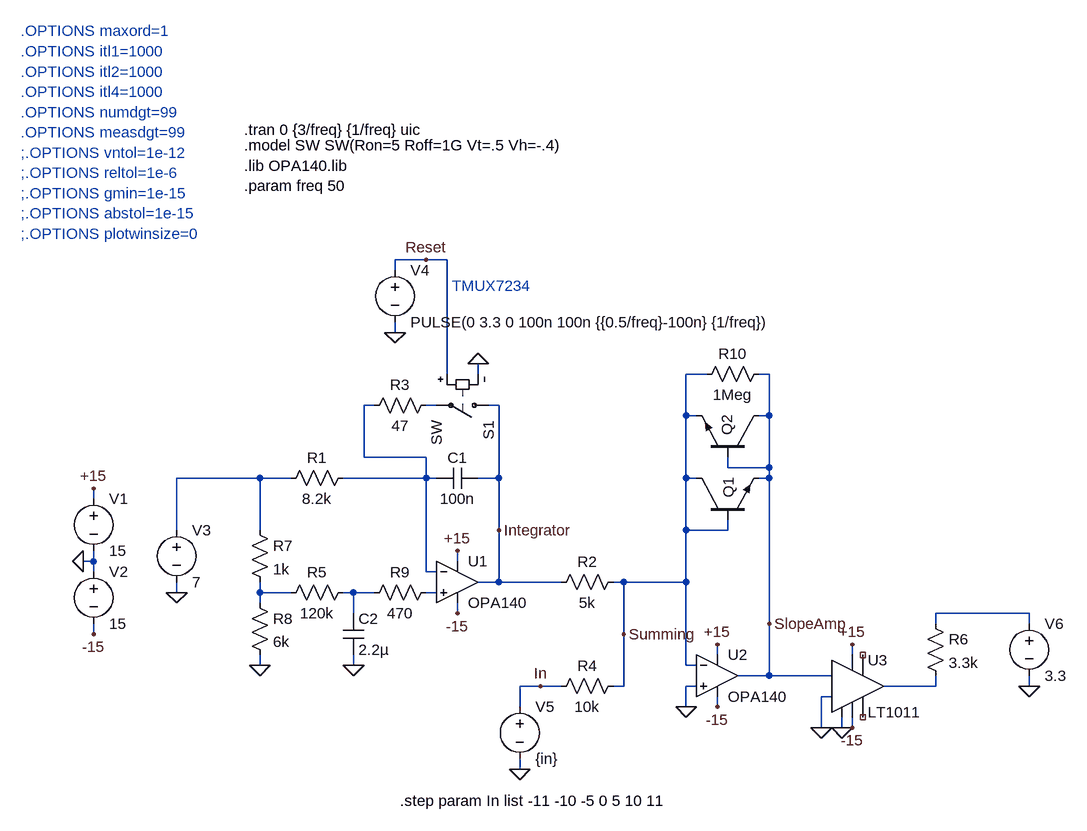
[diagram p0: schematic Single slope ADC v0.4.asc]
Single slope ADC v0.4.asc, the LTspice schematic file:
Version 4
SHEET 1 1672 760
WIRE -16 -416 -64 -416
WIRE 16 -416 -16 -416
WIRE -64 -400 -64 -416
WIRE -64 -304 -64 -320
WIRE 16 -240 16 -416
WIRE 64 -240 64 -256
WIRE 416 -240 384 -240
WIRE 512 -240 496 -240
WIRE -96 -192 -112 -192
WIRE 0 -192 -16 -192
WIRE 96 -192 80 -192
WIRE 384 -176 384 -240
WIRE 400 -176 384 -176
WIRE 512 -176 512 -240
WIRE 512 -176 496 -176
WIRE -112 -112 -112 -192
WIRE -16 -112 -112 -112
WIRE 448 -96 448 -112
WIRE 512 -96 512 -176
WIRE 512 -96 448 -96
WIRE -272 -80 -400 -80
WIRE -224 -80 -272 -80
WIRE -16 -80 -16 -112
WIRE -16 -80 -144 -80
WIRE 0 -80 -16 -80
WIRE 96 -80 96 -192
WIRE 96 -80 64 -80
WIRE 384 -80 384 -176
WIRE 400 -80 384 -80
WIRE 512 -80 512 -96
WIRE 512 -80 496 -80
WIRE -528 -48 -528 -64
WIRE -400 0 -400 -80
WIRE -272 0 -272 -80
WIRE 96 0 96 -80
WIRE 384 0 384 -80
WIRE 448 0 448 -16
WIRE 448 0 384 0
WIRE -528 48 -528 32
WIRE -528 48 -544 48
WIRE 32 48 32 32
WIRE -528 64 -528 48
WIRE -16 64 -16 -80
WIRE 0 64 -16 64
WIRE 96 80 96 0
WIRE 96 80 64 80
WIRE 192 80 96 80
WIRE 288 80 272 80
WIRE 384 80 384 0
WIRE 384 80 288 80
WIRE -400 96 -400 80
WIRE -272 96 -272 80
WIRE -224 96 -272 96
WIRE -128 96 -144 96
WIRE -96 96 -128 96
WIRE 0 96 -16 96
WIRE -272 112 -272 96
WIRE -128 128 -128 96
WIRE 32 128 32 112
WIRE 912 128 768 128
WIRE 512 144 512 -80
WIRE 768 144 768 128
WIRE 912 144 912 128
WIRE -528 160 -528 144
WIRE 288 160 288 80
WIRE 432 192 432 176
WIRE 640 192 640 176
WIRE -272 208 -272 192
WIRE -128 208 -128 192
WIRE 384 208 384 80
WIRE 400 208 384 208
WIRE 512 224 512 144
WIRE 512 224 464 224
WIRE 608 224 512 224
WIRE 160 240 128 240
WIRE 192 240 160 240
WIRE 288 240 288 160
WIRE 288 240 272 240
WIRE 400 240 384 240
WIRE 768 240 768 224
WIRE 768 240 688 240
WIRE 912 240 912 224
WIRE 608 256 592 256
WIRE 128 272 128 240
WIRE 384 272 384 240
WIRE 432 272 432 256
WIRE 592 304 592 256
WIRE 624 304 624 288
WIRE 640 304 640 288
WIRE 128 368 128 352
FLAG -544 48 0
FLAG -528 -64 +15
FLAG 32 32 +15
FLAG -528 160 -15
FLAG 32 128 -15
FLAG -400 96 0
FLAG 64 -256 0
FLAG -64 -304 0
FLAG 96 0 Integrator
FLAG 128 368 0
FLAG 288 160 Summing
FLAG 432 176 +15
FLAG 432 272 -15
FLAG 384 272 0
FLAG 512 144 SlopeAmp
FLAG -16 -416 Reset
FLAG 592 304 0
FLAG 624 304 0
FLAG 640 176 +15
FLAG 640 304 -15
FLAG 912 240 0
FLAG -272 208 0
FLAG 160 240 In
FLAG -128 208 0
SYMBOL OpAmps\\opamp2 32 16 R0
SYMATTR InstName U1
SYMATTR Value OPA140
SYMBOL voltage -528 -64 R0
WINDOW 123 0 0 Left 0
WINDOW 39 0 0 Left 0
SYMATTR InstName V1
SYMATTR Value 15
SYMBOL voltage -528 48 R0
WINDOW 123 0 0 Left 0
WINDOW 39 0 0 Left 0
SYMATTR InstName V2
SYMATTR Value 15
SYMBOL cap 64 -96 R90
WINDOW 0 0 32 VBottom 2
WINDOW 3 32 32 VTop 2
SYMATTR InstName C1
SYMATTR Value 100n
SYMBOL voltage -400 -16 R0
WINDOW 123 0 0 Left 0
WINDOW 39 0 0 Left 0
SYMATTR InstName V3
SYMATTR Value 7
SYMBOL res -128 -96 R90
WINDOW 0 0 56 VBottom 2
WINDOW 3 32 56 VTop 2
SYMATTR InstName R1
SYMATTR Value 8.2k
SYMBOL sw 96 -192 R90
SYMATTR InstName S1
SYMBOL voltage -64 -416 R0
WINDOW 123 0 0 Left 0
WINDOW 39 0 0 Left 0
SYMATTR InstName V4
SYMATTR Value PULSE(0 3.3 0 100n 100n {{0.5/freq}-100n} {1/freq})
SYMBOL res 288 64 R90
WINDOW 0 0 56 VBottom 2
WINDOW 3 32 56 VTop 2
SYMATTR InstName R2
SYMATTR Value 5k
SYMBOL res 288 224 R90
WINDOW 0 0 56 VBottom 2
WINDOW 3 32 56 VTop 2
SYMATTR InstName R4
SYMATTR Value 10k
SYMBOL voltage 128 256 R0
WINDOW 123 0 0 Left 0
WINDOW 39 0 0 Left 0
SYMATTR InstName V5
SYMATTR Value {in}
SYMBOL OpAmps\\opamp2 432 160 R0
SYMATTR InstName U2
SYMATTR Value OPA140
SYMBOL Comparators\\LT1011 640 240 R0
SYMATTR InstName U3
SYMBOL res 752 128 R0
SYMATTR InstName R6
SYMATTR Value 3.3k
SYMBOL voltage 912 128 R0
WINDOW 123 0 0 Left 0
WINDOW 39 0 0 Left 0
SYMATTR InstName V6
SYMATTR Value 3.3
SYMBOL res -288 -16 R0
SYMATTR InstName R7
SYMATTR Value 1k
SYMBOL res -288 96 R0
SYMATTR InstName R8
SYMATTR Value 6k
SYMBOL res 0 -208 R90
WINDOW 0 0 56 VBottom 2
WINDOW 3 32 56 VTop 2
SYMATTR InstName R3
SYMATTR Value 47
SYMBOL npn 400 -16 R270
WINDOW 0 33 49 Left 2
WINDOW 3 56 68 Invisible 2
SYMATTR InstName Q1
SYMATTR Value 2N3904
SYMBOL npn 496 -112 M270
WINDOW 0 33 49 Left 2
WINDOW 3 56 68 Invisible 2
SYMATTR InstName Q2
SYMATTR Value 2N3904
SYMBOL cap -144 128 R0
SYMATTR InstName C2
SYMATTR Value 2.2µ
SYMBOL res -128 80 R90
WINDOW 0 0 56 VBottom 2
WINDOW 3 32 56 VTop 2
SYMATTR InstName R5
SYMATTR Value 120k
SYMBOL res 0 80 R90
WINDOW 0 0 56 VBottom 2
WINDOW 3 32 56 VTop 2
SYMATTR InstName R9
SYMATTR Value 470
SYMBOL res 512 -256 R90
WINDOW 0 0 56 VBottom 2
WINDOW 3 32 56 VTop 2
SYMATTR InstName R10
SYMATTR Value 1Meg
TEXT -296 -592 Left 2 !.model SW SW(Ron=5 Roff=1G Vt=.5 Vh=-.4)\n.lib OPA140.lib\n.param freq 50
TEXT -296 -616 Left 2 !.tran 0 {3/freq} {1/freq} uic
TEXT -56 416 Left 2 !.step param In list -11 -10 -5 0 5 10 11
TEXT -640 -768 Left 2 ;.OPTIONS maxord=1\n.OPTIONS itl1=1000\n.OPTIONS itl2=1000\n.OPTIONS itl4=1000\n.OPTIONS numdgt=99\n.OPTIONS measdgt=99\n;.OPTIONS vntol=1e-12\n;.OPTIONS reltol=1e-6\n;.OPTIONS gmin=1e-15\n;.OPTIONS abstol=1e-15\n;.OPTIONS plotwinsize=0
TEXT 24 -376 Left 2 ;TMUX7234

The netlist it stands for:
* Single slope ADC v0.4.asc
XU1 N006 N001 +15 -15 Integrator OPA140  ; pins In+ In- V+ V- OUT
V1 +15 0 15
V2 0 -15 15
C1 Integrator N001 100n
V3 N003 0 7
R1 N001 N003 8.2k
S1 Integrator N002 Reset 0 SW
V4 Reset 0 PULSE(0 3.3 0 100n 100n {{0.5/freq}-100n} {1/freq})
R2 Summing Integrator 5k
R4 Summing In 10k
V5 In 0 {in}
XU2 0 Summing +15 -15 SlopeAmp OPA140  ; pins In+ In- V+ V- OUT
XU3 0 0 SlopeAmp -15 NC_01 NC_02 N008 +15 LT1011
R6 N007 N008 3.3k
V6 N007 0 3.3
R7 N003 N004 1k
R8 N004 0 6k
R3 N002 N001 47
Q1 Summing Summing SlopeAmp 0 2N3904
Q2 SlopeAmp SlopeAmp Summing 0 2N3904
C2 N005 0 2.2µ
R5 N005 N004 120k
R9 N006 N005 470
R10 SlopeAmp Summing 1Meg
.model NPN NPN
.model PNP PNP
.lib standard.bjt
.model SW SW(Ron=5 Roff=1G Vt=.5 Vh=-.4)
.lib OPA140.lib
.param freq 50
.tran 0 {3/freq} {1/freq} uic
.step param In list -11 -10 -5 0 5 10 11
* .OPTIONS maxord=1
* .OPTIONS itl1=1000
* .OPTIONS itl2=1000
* .OPTIONS itl4=1000
* .OPTIONS numdgt=99
* .OPTIONS measdgt=99
* ;.OPTIONS vntol=1e-12
* ;.OPTIONS reltol=1e-6
* ;.OPTIONS gmin=1e-15
* ;.OPTIONS abstol=1e-15
* ;.OPTIONS plotwinsize=0
* TMUX7234
.lib LTC1.lib
.backanno
.end